# Altium schematic sheet Fast_Servo.schdoc: Stabilizer v1.1
size 420 x 297 mm; EDA_Number: ARTIQ; Projet: Stabilizer; Author: G.Kasprowicz; CompanyName: WUT ISE; DrawnBy: G.Kasprowicz; Organization: WUT ISE; Address1: PW ISE; Address2: Nowowiejska 15/19 00-665 Warsaw; Address3: gkasprow@gmail.com; DocumentNumber: 1; Revision: 1.0; SheetNumber: 1; SheetTotal: 11; ModifiedBy: -; CheckedDate: -; Title2: Top; DivGrp: WUT ISE; Designer: G.Kasprowicz; ModifiedDate: -; ProjectName: Sensor Box
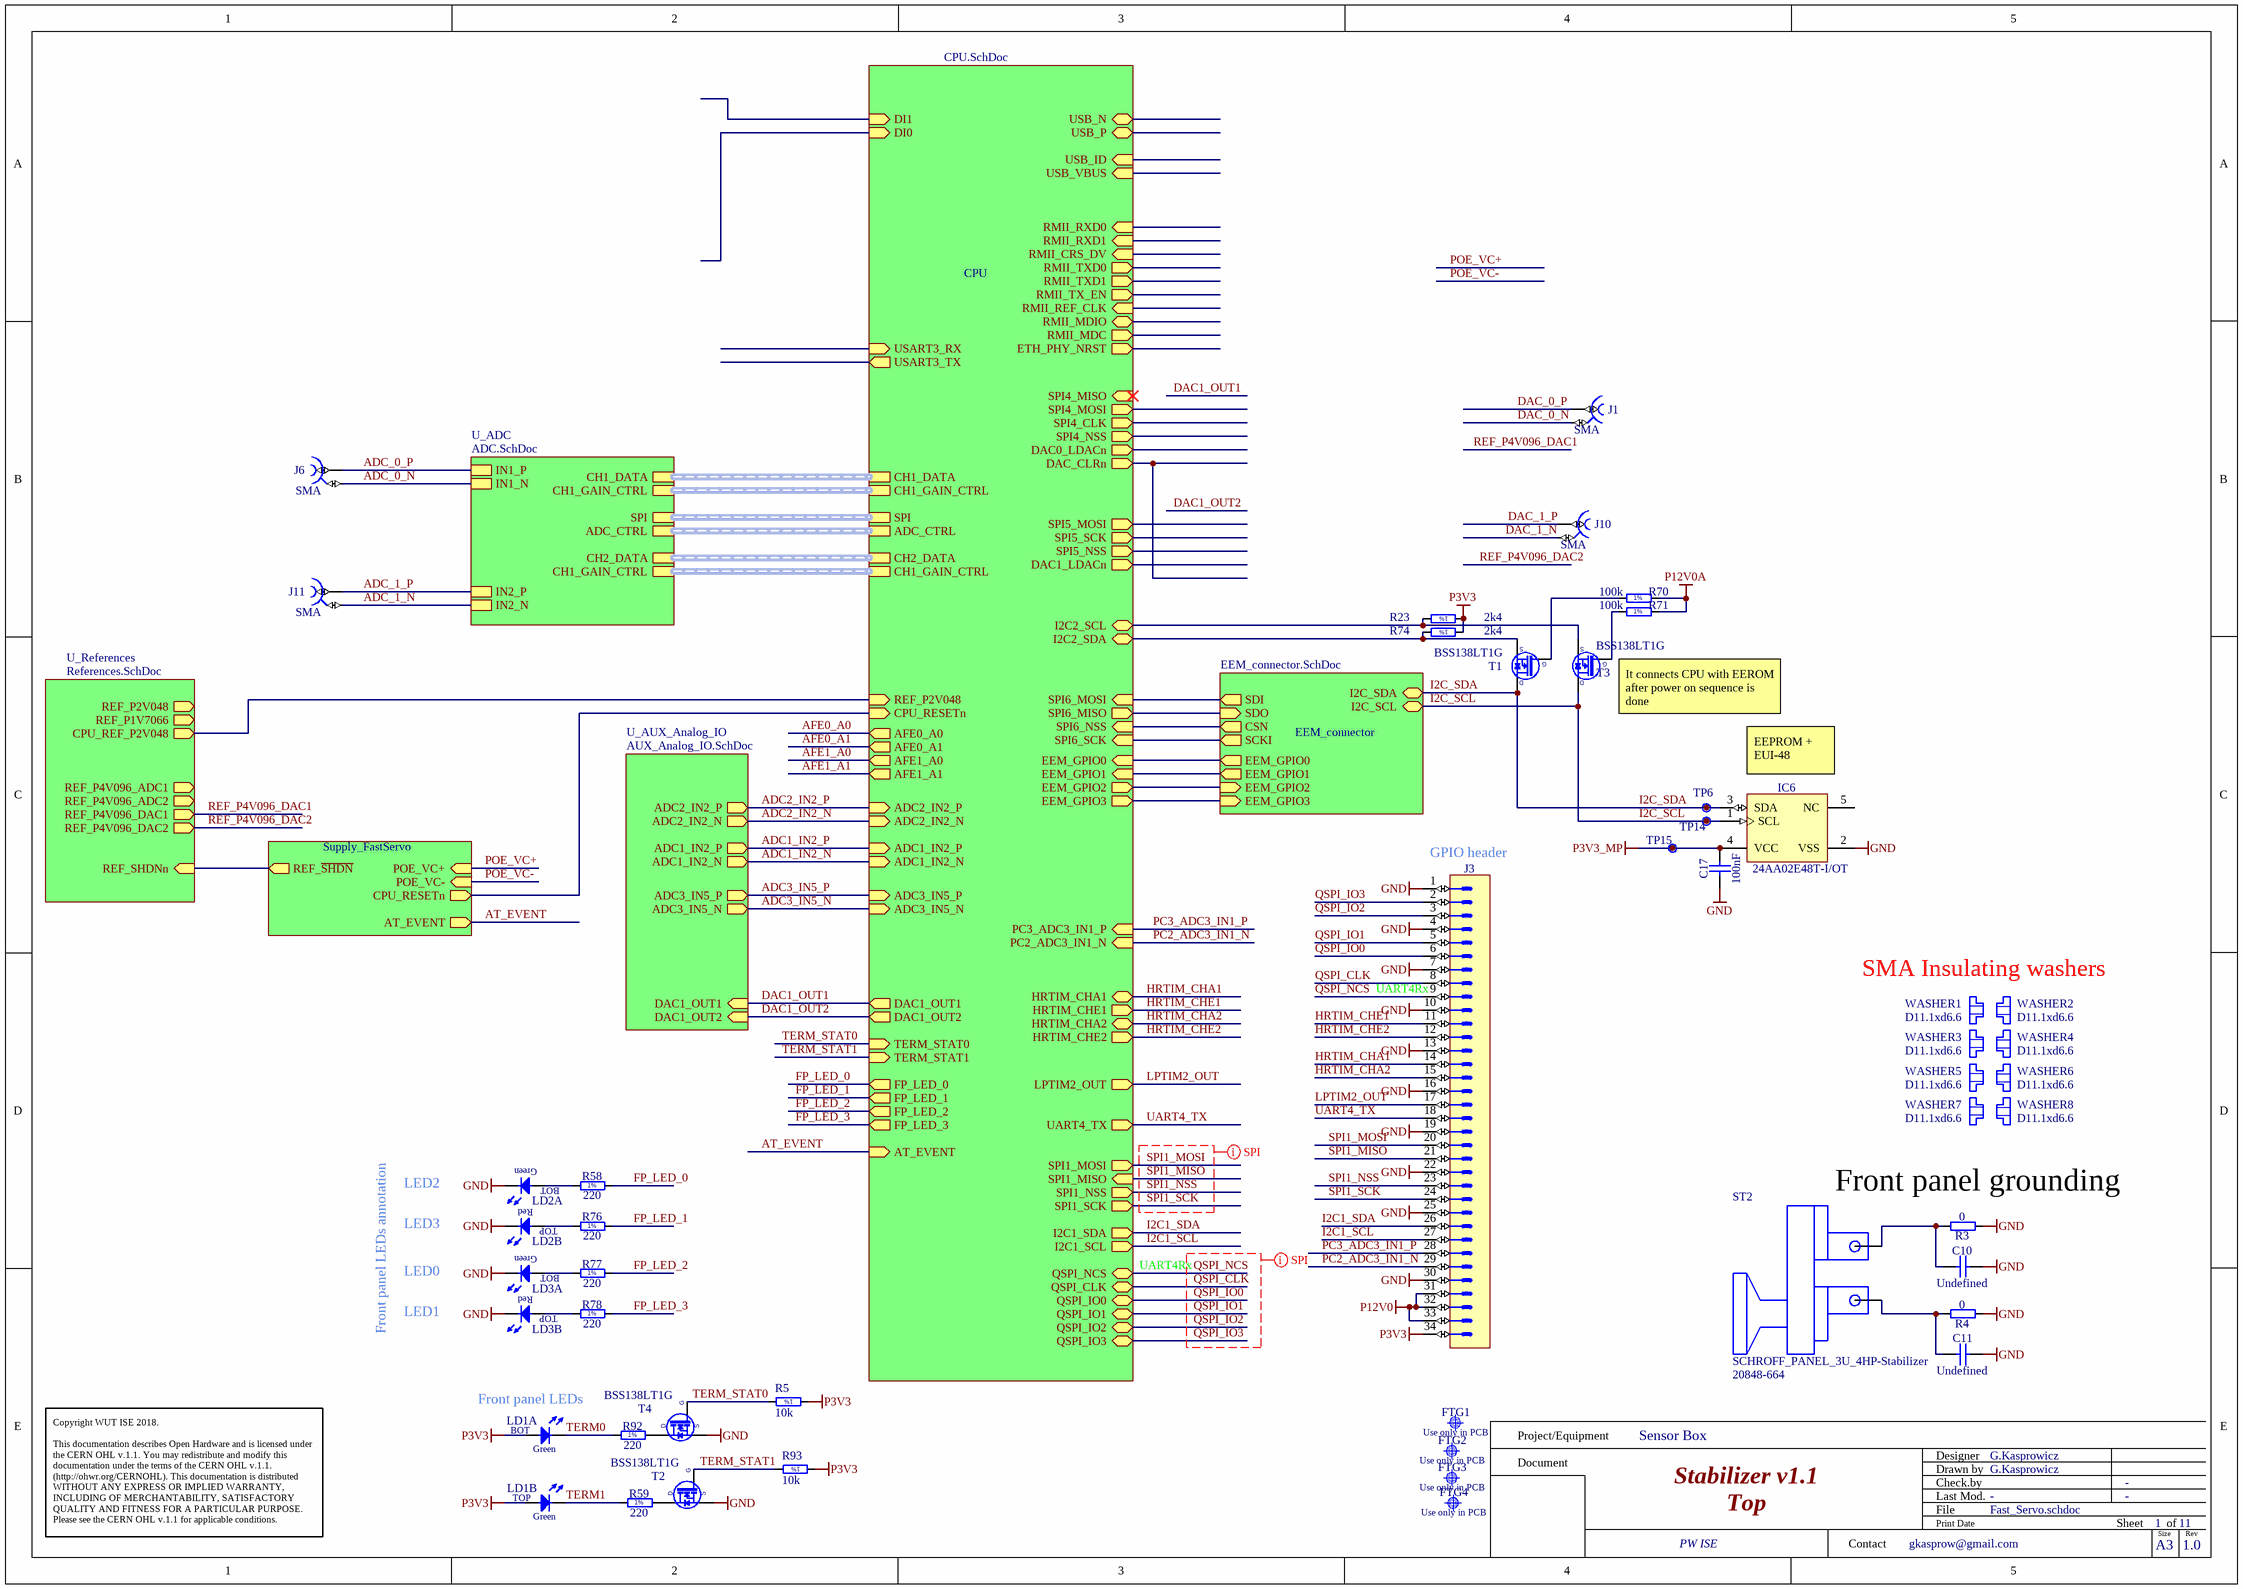
[diagram p0: Fast_Servo.schdoc]

## Parts
C10  Undefined  [CAPC2012X135N]
C11  Undefined  [CAPC2012X135N]
C17  100nF  [CAPC1005X55N]
FTG1  Use only in PCB  [FIDUCIAL_TOP_C100-200]
FTG2  Use only in PCB  [FIDUCIAL_TOP_S100-200]
FTG3  Use only in PCB  [FIDUCIAL_TOP_S100-200]
FTG4  Use only in PCB  [FIDUCIAL_TOP_S100-200]
IC6  24AA02E48T-I/OT  [SOT95P280X145-5N]
J1  SMA  [RF249BT0050GHDW]
J3  Header 34  [3M_N2534-6002RB]  (value not drawn)
J6  SMA  [RF249BT0050GHDW]
J10  SMA  [RF249BT0050GHDW]
J11  SMA  [RF249BT0050GHDW]
LD1  Green/Green  [LED_DIALIGHT_571-0122F]  (value not drawn)  (parts A,B of 2)
LD2  Red/Green  [LED_DIALIGHT_571-0112F]  (value not drawn)  (parts A,B of 2)
LD3  Red/Green  [LED_DIALIGHT_571-0112F]  (value not drawn)  (parts A,B of 2)
R3  0  [RESC1608X55N]
R4  0  [RESC1608X55N]
R5  10k  [RESC1005X40N]
R23  2k4  [RESC1005X40N]
R58  220  [RESC1608X55N]
R59  220  [RESC1608X55N]
R70  100k  [RESC1005X40N]
R71  100k  [RESC1005X40N]
R74  2k4  [RESC1005X40N]
R76  220  [RESC1608X55N]
R77  220  [RESC1608X55N]
R78  220  [RESC1608X55N]
R92  220  [RESC1608X55N]
R93  10k  [RESC1005X40N]
ST2  SCHROFF_PANEL_3U_4HP-Stabilizer  Manufacturer Part Number 2: 20848-664  [SCHROFF_PANEL_3HP_4U - Stabilizer]
T1  BSS138LT1G  [SOT95P240X110-3N]
T2  BSS138LT1G  [SOT95P240X110-3N]
T3  BSS138LT1G  [SOT95P240X110-3N]
T4  BSS138LT1G  [SOT95P240X110-3N]
TP6  Test Point  [TPS127]  (value not drawn)
TP14  Test Point  [TPS127]  (value not drawn)
TP15  Test Point  [TPS127]  (value not drawn)
WASHER1  D11.1xd6.6  [Keystone_7687]
WASHER2  D11.1xd6.6  [Keystone_7687]
WASHER3  D11.1xd6.6  [Keystone_7687]
WASHER4  D11.1xd6.6  [Keystone_7687]
WASHER5  D11.1xd6.6  [Keystone_7687]
WASHER6  D11.1xd6.6  [Keystone_7687]
WASHER7  D11.1xd6.6  [Keystone_7687]
WASHER8  D11.1xd6.6  [Keystone_7687]

## Sub-sheets
CPU = CPU.SchDoc: USB_N (bidir), USB_P (bidir), USB_ID (in), USB_VBUS (in), RMII_TXD0 (out), RMII_TX_EN (out), RMII_RXD0 (in), RMII_REF_CLK (in), RMII_CRS_DV (in), RMII_MDC (out), RMII_MDIO (bidir), RMII_TXD1 (out), RMII_RXD1 (in), DAC1_OUT1 (out), ADC1_IN2_P (in), I2C2_SDA (bidir), SPI6_MOSI (in), I2C2_SCL (bidir), DAC1_OUT2 (out), ADC3_IN5_N (in), ADC3_IN5_P (in), SPI6_MISO (out), SPI6_NSS (in), ADC1_IN2_N (in), PC3_ADC3_IN1_P (in), PC2_ADC3_IN1_N (in), SPI6_SCK (in), USART3_TX (out), USART3_RX (in), AFE1_A1 (out), DI0 (in), DI1 (in), DAC0_LDACn (out), DAC1_LDACn (out), DAC_CLRn (out), CPU_RESETn (in), EEM_GPIO0 (in), EEM_GPIO1 (in), EEM_GPIO2 (out), EEM_GPIO3 (out), I2C1_SDA (out), I2C1_SCL (out), UART4_TX (out), HRTIM_CHE1 (out), HRTIM_CHA2 (bidir), HRTIM_CHA1 (bidir), LPTIM2_OUT (out), HRTIM_CHE2 (out), TERM_STAT0 (in), TERM_STAT1 (in), REF_P2V048 (in), FP_LED_0 (out), FP_LED_1 (out), FP_LED_2 (out), FP_LED_3 (out), ADC2_IN2_P (in), ADC2_IN2_N (in), AT_EVENT (in), ETH_PHY_NRST (out), SPI1_SCK (out), SPI1_NSS (out), SPI1_MISO (in), SPI1_MOSI (out), SPI4_MOSI (out), SPI4_NSS (out), SPI4_CLK (out), SPI4_MISO (in), SPI5_NSS (out), SPI5_SCK (out), SPI5_MOSI (out), QSPI_IO0 (bidir), QSPI_NCS (bidir), QSPI_IO3 (bidir), QSPI_CLK (bidir), QSPI_IO1 (bidir), QSPI_IO2 (bidir), AFE0_A0 (out), AFE0_A1 (out), AFE1_A0 (out), SPI (harness LTC2195_SPI), CH1_GAIN_CTRL (harness ADC_GAIN_CTRL), CH1_GAIN_CTRL (harness ADC_GAIN_CTRL), CH1_DATA (harness LTC2195_DATA), ADC_CTRL (harness LTC2195_CTRL), CH2_DATA (harness LTC2195_DATA)
EEM_connector = EEM_connector.SchDoc: I2C_SDA (bidir), I2C_SCL (bidir), EEM_GPIO0 (out), EEM_GPIO1 (out), EEM_GPIO2 (in), EEM_GPIO3 (in), SCKI (out), SDI (out), CSN (out), SDO (in)
Supply_FastServo = Supply_FastServo.SchDoc: REF_~{SHDN} (out), POE_VC+ (in), POE_VC- (in), CPU_RESETn (out), AT_EVENT (out)
U_ADC = ADC.SchDoc: IN1_P, IN2_P, IN1_N, IN2_N, SPI (harness LTC2195_SPI), CH1_GAIN_CTRL (harness ADC_GAIN_CTRL), CH1_GAIN_CTRL (harness ADC_GAIN_CTRL), CH1_DATA (harness LTC2195_DATA), ADC_CTRL (harness LTC2195_CTRL), CH2_DATA (harness LTC2195_DATA)
U_AUX_Analog_IO = AUX_Analog_IO.SchDoc: DAC1_OUT1 (in), ADC1_IN2_P (out), DAC1_OUT2 (in), ADC3_IN5_N (out), ADC3_IN5_P (out), ADC1_IN2_N (out), ADC2_IN2_P (out), ADC2_IN2_N (out)
U_References = References.SchDoc: REF_SHDNn (in), REF_P4V096_ADC2 (out), REF_P2V048 (out), REF_P1V7066 (out), REF_P4V096_DAC2 (out), REF_P4V096_DAC1 (out), CPU_REF_P2V048 (out), REF_P4V096_ADC1 (out)

## Nets
GND: C10.2 C11.2 C17.1 IC6.2(VSS) J3.1 J3.4 J3.7 J3.10 J3.13 J3.16 J3.19 J3.22 J3.25 J3.30 LD2.1(C) LD2.3(C) LD3.1(C) LD3.3(C) R3.1 R4.1 T2.2(S) T4.2(S)
P3V3: J3.34 LD1.2(A) LD1.4(A) R5.1 R23.1 R74.1 R93.1
P3V3_MP: C17.2 IC6.4(VCC) TP15.1
P12V0: J3.31 J3.32 J3.33
P12V0A: R70.2 R71.2
ADC1_IN2_N: sheet CPU/ADC1_IN2_N, sheet U_AUX_Analog_IO/ADC1_IN2_N
ADC1_IN2_P: sheet CPU/ADC1_IN2_P, sheet U_AUX_Analog_IO/ADC1_IN2_P
ADC2_IN2_N: sheet CPU/ADC2_IN2_N, sheet U_AUX_Analog_IO/ADC2_IN2_N
ADC2_IN2_P: sheet CPU/ADC2_IN2_P, sheet U_AUX_Analog_IO/ADC2_IN2_P
ADC3_IN5_N: sheet CPU/ADC3_IN5_N, sheet U_AUX_Analog_IO/ADC3_IN5_N
ADC3_IN5_P: sheet CPU/ADC3_IN5_P, sheet U_AUX_Analog_IO/ADC3_IN5_P
ADC_0_N: J6.2 ; sheet U_ADC/IN1_N
ADC_0_P: J6.1 ; sheet U_ADC/IN1_P
ADC_1_N: J11.2 ; sheet U_ADC/IN2_N
ADC_1_P: J11.1 ; sheet U_ADC/IN2_P
AFE0_A0: sheet CPU/AFE0_A0
AFE0_A1: sheet CPU/AFE0_A1
AFE1_A0: sheet CPU/AFE1_A0
AFE1_A1: sheet CPU/AFE1_A1
AT_EVENT: sheet Supply_FastServo/AT_EVENT, sheet CPU/AT_EVENT
DAC1_OUT1: sheet CPU/DAC1_OUT1, sheet U_AUX_Analog_IO/DAC1_OUT1
DAC1_OUT2: sheet CPU/DAC1_OUT2, sheet U_AUX_Analog_IO/DAC1_OUT2
DAC_0_N: J1.2
DAC_0_P: J1.1
DAC_1_N: J10.2
DAC_1_P: J10.1
FP_LED_0: R58.2 ; sheet CPU/FP_LED_0
FP_LED_1: R76.2 ; sheet CPU/FP_LED_1
FP_LED_2: R77.2 ; sheet CPU/FP_LED_2
FP_LED_3: R78.2 ; sheet CPU/FP_LED_3
HRTIM_CHA1: J3.14 ; sheet CPU/HRTIM_CHA1
HRTIM_CHA2: J3.15 ; sheet CPU/HRTIM_CHA2
HRTIM_CHE1: J3.11 ; sheet CPU/HRTIM_CHE1
HRTIM_CHE2: J3.12 ; sheet CPU/HRTIM_CHE2
I2C1_SCL: J3.27 ; sheet CPU/I2C1_SCL
I2C1_SDA: J3.26 ; sheet CPU/I2C1_SDA
I2C_SCL: IC6.1(SCL) T3.3(D) TP14.1 ; sheet EEM_connector/I2C_SCL
I2C_SDA: IC6.3(SDA) T1.3(D) TP6.1 ; sheet EEM_connector/I2C_SDA
LPTIM2_OUT: J3.17 ; sheet CPU/LPTIM2_OUT
PC2_ADC3_IN1_N: J3.29 ; sheet CPU/PC2_ADC3_IN1_N
PC3_ADC3_IN1_P: J3.28 ; sheet CPU/PC3_ADC3_IN1_P
POE_VC+: sheet Supply_FastServo/POE_VC+
POE_VC-: sheet Supply_FastServo/POE_VC-
QSPI_CLK: J3.8 ; sheet CPU/QSPI_CLK
QSPI_IO0: J3.6 ; sheet CPU/QSPI_IO0
QSPI_IO1: J3.5 ; sheet CPU/QSPI_IO1
QSPI_IO2: J3.3 ; sheet CPU/QSPI_IO2
QSPI_IO3: J3.2 ; sheet CPU/QSPI_IO3
QSPI_NCS: J3.9 ; sheet CPU/QSPI_NCS
REF_P4V096_DAC1: sheet U_References/REF_P4V096_DAC1
REF_P4V096_DAC2: sheet U_References/REF_P4V096_DAC2
SPI1_MISO: J3.21 ; sheet CPU/SPI1_MISO
SPI1_MOSI: J3.20 ; sheet CPU/SPI1_MOSI
SPI1_NSS: J3.23 ; sheet CPU/SPI1_NSS
SPI1_SCK: J3.24 ; sheet CPU/SPI1_SCK
TERM0: LD1.1(C) R92.1
TERM1: LD1.3(C) R59.1
TERM_STAT0: R5.2 T4.1(G) ; sheet CPU/TERM_STAT0
TERM_STAT1: R93.2 T2.1(G) ; sheet CPU/TERM_STAT1
UART4_TX: J3.18 ; sheet CPU/UART4_TX
NetC10_1: C10.1 R3.2 ST2.1
NetC11_1: C11.1 R4.2 ST2.0
NetLD2_2: LD2.2(A) R58.1
NetLD2_4: LD2.4(A) R76.1
NetLD3_2: LD3.2(A) R77.1
NetLD3_4: LD3.4(A) R78.1
NetR23_2: R23.2 T3.2(S) ; sheet CPU/I2C2_SCL
NetR59_2: R59.2 T2.3(D)
NetR70_1: R70.1 T1.1(G)
NetR71_1: R71.1 T3.1(G)
NetR74_2: R74.2 T1.2(S) ; sheet CPU/I2C2_SDA
NetR92_2: R92.2 T4.3(D)
(unnamed): sheet Supply_FastServo/REF_~{SHDN}, sheet U_References/REF_SHDNn
(unnamed): sheet Supply_FastServo/CPU_RESETn, sheet CPU/CPU_RESETn
(unnamed): sheet CPU/SPI6_MOSI, sheet EEM_connector/SDI
(unnamed): sheet CPU/SPI6_MISO, sheet EEM_connector/SDO
(unnamed): sheet CPU/SPI6_NSS, sheet EEM_connector/CSN
(unnamed): sheet CPU/SPI6_SCK, sheet EEM_connector/SCKI
(unnamed): sheet CPU/EEM_GPIO0, sheet EEM_connector/EEM_GPIO0
(unnamed): sheet CPU/EEM_GPIO1, sheet EEM_connector/EEM_GPIO1
(unnamed): sheet CPU/EEM_GPIO2, sheet EEM_connector/EEM_GPIO2
(unnamed): sheet CPU/EEM_GPIO3, sheet EEM_connector/EEM_GPIO3
(unnamed): sheet CPU/REF_P2V048, sheet U_References/CPU_REF_P2V048

Not connected (* = marked no-connect by the designer): IC6 5(NC)

## Buses and harness runs
harness sheet CPU/ADC_CTRL = sheet U_ADC/ADC_CTRL
harness sheet CPU/CH1_DATA = sheet U_ADC/CH1_DATA
harness sheet CPU/CH1_GAIN_CTRL = sheet U_ADC/CH1_GAIN_CTRL
harness sheet CPU/CH2_DATA = sheet U_ADC/CH2_DATA
harness sheet CPU/SPI = sheet U_ADC/SPI

## Layout directives
net class SPI: QSPI_CLK, QSPI_IO0, QSPI_IO1, QSPI_IO2, QSPI_IO3, QSPI_NCS, SPI1_MISO, SPI1_MOSI, SPI1_NSS, SPI1_SCK

## Notes on the sheet
- (near T3) It connects CPU with EEROM after power on sequence is done
- EEPROM + EUI-48
- (near J3) GPIO header
- (near J3) UART4Rx
- SMA Insulating washers
- LED2
- (near R3) Front panel grounding
- LED3
- UART4Rx
- Front panel LEDs annotation
- LED0
- LED1
- Front panel LEDs
- Project/Equipment
- Document
- Designer
- Drawn by
- Check.by
- Copyright WUT ISE 2018.
  This documentation describes Open Hardware and is licensed under the CERN OHL v.1.1. You may redistribute and modify this documentation under the terms of the CERN OHL v.1.1. (http://ohwr.org/CERNOHL). This documentation is distributed WITHOUT ANY EXPRESS OR IMPLIED WARRANTY, INCLUDING OF MERCHANTABILITY, SATISFACTORY QUALITY AND FITNESS FOR A PARTICULAR PURPOSE. Please see the CERN OHL v.1.1 for applicable conditions.
- Contact
- File
- Last Mod.
- Print Date
- Sheet
- Size
- A3
- of
- Rev
- (in symbol LED_DIALIGHT_571-0112F, part A) Green; BOT
- (in symbol LED_DIALIGHT_571-0112F, part B) Red; TOP
- (in symbol LED_DIALIGHT_571-0122F, part A) BOT; Green
- (in symbol LED_DIALIGHT_571-0122F, part B) TOP; Green
- (in symbol R0402_2K4_1%_0.0625W_100PPM) 1%
- (in symbol R0402_10K_1%_0.0625W_100PPM) 1%
- (in symbol R0402_100K_1%_0.0625W_100PPM) 1%
- (in symbol R0603_220R_1%_0.1W_100PPM) 1%

## Library data of the parts
C10 C11 = CC0805_NO-VALUE: Non-polarised capacitor; Part Description: Reserved Footprint For 0805(2012) Chip Ceramic Capacitor; Mounted: No; Part Number: CC0805_NO-VALUE; Component Kind: Standard; Component Type: Standard; Pin Count: 2; Value: Undefined; Status: None; Manufacturer: Undefined; Manufacturer Part Number: CC0805_NO-VALUE; Case: 0805; Socket: No; SMD: Yes; Sense: No; Manufacturer1 ComponentHeight: 1.35mm; HelpURL: Undefined; Author: CERN DEM JLC; CreateDate: 10.12.2008; LatestRevisionDate: 11.09.2013
C17 = CC0402_100NF_16V_10%_X5R: Non-polarised capacitor; Part Description: SMD Multilayer Chip Ceramic Capacitor; Manufacturer: GENERIC; Manufacturer1 Part Number: GRM155R61C104KA88D; Voltage: 16V; TC: X5R; Tolerance: ±10%; Part Number: CC0402_100NF_16V_10%_X5R; Component Kind: Standard; Component Type: Standard; Pin Count: 2; Value: 100nF; Status: None; Manufacturer Part Number: CC0402_100NF_16V_10%_X5R; Case: 0402; Mounted: Yes; Socket: No; SMD: Yes; Sense: No; Manufacturer1 Example: MURATA; Manufacturer1 ComponentHeight: 0.55mm; HelpURL: \\cern.ch\dfs\Applications\Altium\Datasheets\CC0402_X5R_MURATA_GRM.pdf; Author: CERN DEM JLC; CreateDate: 10.12.2013; LatestRevisionDate: 10.12.2013
FTG1 = FIDUCIAL_TARGET_C100-200: Fiducial Target; Part Description: Round Fiducial Target, Top Layer, 1.0mm, Top Solder 2.0mm, Keepout =2.0mm; Mounted: No; Part Number: FIDUCIAL_TARGET_C100-200; Component Kind: Standard (No BOM); Component Type: Standard (No BOM); Pin Count: 1; Family: Fiducial; Socket: No; SMD: Yes; Sense: No; Status: None; ComponentHeight: 0mm; HelpURL: Undefined; Author: CERN DEM JLC; CreateDate: 09.02.2010; LatestRevisionDate: 04.04.2012; PackageDescription: Round Fiducial Target, Top Layer, 1.0mm, Top Solder 2.0mm, Keepout =2.0mm
FTG2-FTG4 = FIDUCIAL_TARGET_S100-200: Fiducial Target; Part Description: Square Fiducial Target, Top Layer, 1.0mm, Top Solder 2.0mm, Keepout =2.0mm; Mounted: No; Part Number: FIDUCIAL_TARGET_S100-200; Component Kind: Standard (No BOM); Component Type: Standard (No BOM); Pin Count: 1; Family: Fiducial; Socket: No; SMD: Yes; Sense: No; Status: None; ComponentHeight: 0mm; HelpURL: Undefined; Author: CERN DEM JLC; CreateDate: 09.02.2010; LatestRevisionDate: 04.04.2012; PackageDescription: Square Fiducial Target, Top Layer, 1.0mm, Top Solder 2.0mm, Keepout =2.0mm
IC6 = 24AA02E48T-I/OT: 1.7V-5.5V, 2K I2C Serial EEPROM With EUI-48 Node Identity; Manufacturer: MICROCHIP TECHNOLOGY; PressFit: No; Bonding: No; Part Number: 24AA02E48T-I/OT; Component Kind: Standard; Component Type: Standard; Device: 24AA02E48T-I/OT; PackageDescription: SOT, 0.95mm pitch; 5 pin, 1.60mm W X 2.90mm L X 1.45mm H body, IPC Medium Density; Part Description: 1.7V-5.5V, 2K I2C Serial EEPROM With EUI-48 Node Identity; Manufacturer Part Number: 24AA02E48T-I/OT; Pin Count: 5; Case: SOT23-5; Mounted: Yes; Socket: No; SMD: Yes; Sense: No; ComponentHeight: 1.45mm; HelpURL: \\cern.ch\dfs\Applications\Altium\Datasheets\24AA02E48T-I-OT.pdf; Author: CERN DEM MR; CreateDate: 31.03.2016; LatestRevisionDate: 31.03.2016
J1 J6 J10 J11 = CON_SMA_RF249BT0050GHDW: 50 Ohm Through Hole SMA Right Angle PCB Jack; Part Number: AdamTech_RF249BT0050GHDW; Manufacturer: AdamTech; PressFit: No; Component Kind: Standard; Component Type: Standard; Pin Count: 5; Family: SMA; Mounted: Yes; Socket: No; SMD: No; Sense: No; Status: None; Part Description: 50 Ohm Through Hole SMA Right Angle PCB Jack; Manufacturer Part Number: RF249BT0050GHDW; ComponentHeight: 10.44mm; HelpURL: \\cern.ch\dfs\Applications\Altium\Datasheets\AMPHENOL_132203.pdf; Author: GK; CreateDate: 06.10.2016; LatestRevisionDate: 06.10.2016
J3 = 3M_N2534-6002RB: Connector 34 Male; Part Description: 34 Contacts - Straight .100'' x .100'' Low Profile Four-Wall Header, 2500 Series; Manufacturer: 3M; PressFit: No; Part Number: 3M_N2534-6002RB; Component Kind: Standard; Component Type: Standard; Pin Count: 34; Family: Header 34; Mounted: Yes; Socket: No; SMD: No; Sense: No; Status: None; Manufacturer Part Number: N2534-6002RB; ComponentHeight: 10.03mm; HelpURL: \\cern.ch\dfs\Applications\Altium\Datasheets\3M_N2534-6002RB.pdf; Author: CERN DEM JLC; CreateDate: 11.02.2009; LatestRevisionDate: 11.08.2009
LD1 = LED_DIALIGHT_571-0122F: LED x2 Green 1C2A-BOT_3C4A-TOP; Part Description: Dual 2mm Green LEDs CBI® Circuit Board Indicator (Without positioning pins); PressFit: No; Bonding: No; Part Number: LED_DIALIGHT_571-0122F; Component Kind: Standard; Component Type: Standard; Color: Green/Green; PackageDescription: 2x 2mm Red LED PCB Edge Mounting (Without positioning pins) DIALIGHT 571 Serie; Manufacturer: DIALIGHT; Manufacturer Part Number: 571-0122F; Pin Count: 4; Mounted: Yes; Socket: No; SMD: No; Sense: No; ComponentHeight: 8.6mm; HelpURL: \\cern.ch\dfs\Applications\Altium\Datasheets\LED_DIALIGHT_571-0122F.pdf; Author: CERN DEM JLC; CreateDate: 09.11.2009; LatestRevisionDate: 17.03.2010
LD2 LD3 = LED_DIALIGHT_571-0112F: 2x LED  Botom Green, Top Red; Part Description: Dual 2mm  LEDs, Red Top,Green Bot, CBI® Circuit Board Indicator (Without positioning pins); PressFit: No; Bonding: No; Part Number: LED_DIALIGHT_571-0112F; Component Kind: Standard; Component Type: Standard; Color: Red/Green; PackageDescription: 2x 2mm LED (Top: Red, Bot: Green) PCB Edge Mounting (Without positioning pins) DIALIGHT 571 Serie; Manufacturer: DIALIGHT; Manufacturer Part Number: 571-0112F; Pin Count: 4; Mounted: Yes; Socket: No; SMD: No; Sense: No; ComponentHeight: 8.6mm; HelpURL: \\cern.ch\dfs\Applications\Altium\Datasheets\LED_DIALIGHT_571-0112F.pdf; Author: CERN DEM JLC; CreateDate: 09/11/2009; LatestRevisionDate: 17/03/2010
R3 R4 = R0603_0R_JUMPER: Resistor; Part Description: 1A (0.05R Max DC Resistance) Zero Ohm Jumper; Manufacturer: GENERIC; Manufacturer1 Part Number: NRC06Z0; PressFit: No; Part Number: R0603_0R_JUMPER; Component Kind: Standard; Component Type: Standard; Pin Count: 2; Value: 0; Status: Preferred; Manufacturer Part Number: R0603_0R_JUMPER; Case: 0603; Mounted: Yes; Sense: No; Socket: No; SMD: Yes; Manufacturer1 Example: NIC COMPONENT; Manufacturer1 ComponentHeight: 0.55mm; HelpURL: \\cern.ch\dfs\Applications\Altium\Datasheets\R0603_NIC_NRC.pdf; Author: CERN DEM JLC; CreateDate: 03.12.2007; LatestRevisionDate: 13.03.2008
R5 R93 = R0402_10K_1%_0.0625W_100PPM: Resistor - 1%; Part Description: General Purpose Thick Film Chip Resistor; Manufacturer: GENERIC; Manufacturer1 Part Number: 232270671003L; TC: ±100ppm/°C; Part Number: R0402_10K_1%_0.0625W_100PPM; Component Kind: Standard; Component Type: Standard; Pin Count: 2; Value: 10k; Status: Not recommended; Power: 0.0625W; Tolerance: ±1%; Manufacturer Part Number: R0402_10K_1%_0.0625W_100PPM; Case: 0402; Mounted: Yes; Sense: No; Socket: No; SMD: Yes; Manufacturer1 Example: YAGEO PHYCOMP; Manufacturer1 ComponentHeight: 0.4mm; HelpURL: \\cern.ch\dfs\Applications\Altium\Datasheets\R0402_Phycomp_RC0402.pdf; Author: CERN DEM JLC; CreateDate: 03.12.2007; LatestRevisionDate: 17.10.2012
R23 R74 = R0402_2K4_1%_0.0625W_100PPM: Resistor - 1%; Part Description: General Purpose Thick Film Chip Resistor; Manufacturer: GENERIC; Manufacturer1 Part Number: 232270672402L; TC: ±100ppm/°C; PressFit: No; Part Number: R0402_2K4_1%_0.0625W_100PPM; Component Kind: Standard; Component Type: Standard; Pin Count: 2; Value: 2k4; Status: Not Recommended; Power: 0.0625W; Tolerance: ±1%; Manufacturer Part Number: R0402_2K4_1%_0.0625W_100PPM; Case: 0402; Mounted: Yes; Sense: No; Socket: No; SMD: Yes; Manufacturer1 Example: YAGEO PHYCOMP; Manufacturer1 ComponentHeight: 0.4mm; HelpURL: \\cern.ch\dfs\Applications\Altium\Datasheets\R0402_Phycomp_RC0402.pdf; Author: CERN DEM JLC; CreateDate: 03.12.2007; LatestRevisionDate: 17.10.2012
R58 R59 R76-R78 R92 = R0603_220R_1%_0.1W_100PPM: Resistor - 1%; Part Description: General Purpose Thick Film Chip Resistor; Manufacturer: GENERIC; Manufacturer1 Part Number: NRC06F2200TRF; Power: 0.1W; TC: ±100ppm/°C; Part Number: R0603_220R_1%_0.1W_100PPM; Component Kind: Standard; Component Type: Standard; Pin Count: 2; Value: 220; Status: Preferred; Tolerance: ±1%; Manufacturer Part Number: R0603_220R_1%_0.1W_100PPM; Case: 0603; Mounted: Yes; Sense: No; Socket: No; SMD: Yes; Manufacturer1 Example: NIC COMPONENT; Manufacturer1 ComponentHeight: 0.55mm; HelpURL: \\cern.ch\dfs\Applications\Altium\Datasheets\R0603_NIC_NRC.pdf; Author: CERN DEM JLC; CreateDate: 03.12.2007; LatestRevisionDate: 13.03.2008
R70 R71 = R0402_100K_1%_0.0625W_100PPM: Resistor - 1%; Part Description: General Purpose Thick Film Chip Resistor; Manufacturer: GENERIC; Manufacturer1 Part Number: 232270671004L; TC: ±100ppm/°C; PressFit: No; Part Number: R0402_100K_1%_0.0625W_100PPM; Component Kind: Standard; Component Type: Standard; Pin Count: 2; Value: 100k; Status: Not Recommended; Power: 0.0625W; Tolerance: ±1%; Manufacturer Part Number: R0402_100K_1%_0.0625W_100PPM; Case: 0402; Mounted: Yes; Sense: No; Socket: No; SMD: Yes; Manufacturer1 Example: YAGEO PHYCOMP; Manufacturer1 ComponentHeight: 0.4mm; HelpURL: \\cern.ch\dfs\Applications\Altium\Datasheets\R0402_Phycomp_RC0402.pdf; Author: CERN DEM JLC; CreateDate: 03/12/2007; LatestRevisionDate: 17/10/2012
ST2 = SCHROFF_PANEL_3U_4HP_Stabilizer: Schroff 3HP 4U EUROCARD Panel; Manufacturer Part Number: 20818-017; Manufacturer: Schroff
T1-T4 = BSS138LT1G: N-CHANNEL MOSFET WITH DIODE; Part Description: 50V 200mA N-Channel Enhancement Mode Field-Effect Transistor; Manufacturer: ON SEMICONDUCTOR; PressFit: No; Bonding: No; Part Number: BSS138LT1G; Component Kind: Standard; Component Type: Standard; Device: BSS138LT1G; PackageDescription: SOT23 3-Leads, Pitch 0.95mm - Body 1.4x3mm, IPC Medium Density; Manufacturer Part Number: BSS138LT1G; Pin Count: 3; Case: SOT23-3; Mounted: Yes; Socket: No; SMD: Yes; Sense: No; ComponentHeight: 1.11mm; HelpURL: \\cern.ch\dfs\Applications\Altium\Datasheets\BSS138LT1G.pdf; Author: CERN DEM JLC; CreateDate: 23.03.2009; LatestRevisionDate: 23.03.2009
TP6 TP14 TP15 = SMD_PAD_1.27X1.27MM: Part Description: 1.27mm x 1.27mm PCB Copper Area (SMD Test Point); Mounted: No; Part Number: SMD_PAD_1.27X1.27MM; Component Kind: Standard (No BOM); Component Type: Standard (No BOM); Pin Count: 1; Family: Test Point; Socket: No; SMD: Yes; Sense: No; Status: None; ComponentHeight: 0mm; HelpURL: Undefined; Author: CERN DEM JLC; CreateDate: 12.01.2008; LatestRevisionDate: 12.01.2008; PackageDescription: 1.27mm x 1.27mm PCB Copper Area (SMD Test Point)
WASHER1-WASHER8 = Keystone_7687: SMA_Shoulder Washer; Part Description: Polyphenylene Sulfide PPS Shoulder Washer; Manufacturer Part Number: 7687; PressFit: No; Part Number: Keystone 7687; Component Kind: Standard; Component Type: Mechanical; Pin Count: 0; PackageDescription: Polyphenylene Sulfide PPS Shoulder Washer; Mounted: Yes; Socket: No; SMD: No; Sense: No; Status: None; Value: D11.1xd6.6; Manufacturer: Keystone; ComponentHeight: 1.91mm; HelpURL: \\cern.ch\dfs\Applications\Altium\Datasheets\AAVID-THERMALLOY_7721-7PPSG.pdf; Author: GK; CreateDate: 28.01.2016; LatestRevisionDate: 28.01.2016